# EAGLE schematic led_board (EAGLE 6.1)
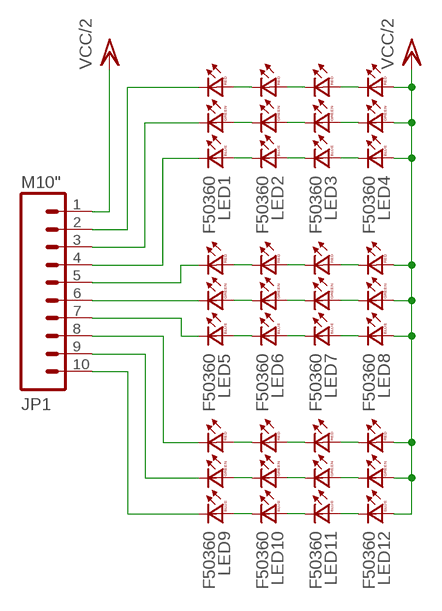
[diagram p0: schematic, sheet 1]

## Parts
JP1  M10"  [1X10]
LED1  F50360  [F50360]
LED2  F50360  [F50360]
LED3  F50360  [F50360]
LED4  F50360  [F50360]
LED5  F50360  [F50360]
LED6  F50360  [F50360]
LED7  F50360  [F50360]
LED8  F50360  [F50360]
LED9  F50360  [F50360]
LED10  F50360  [F50360]
LED11  F50360  [F50360]
LED12  F50360  [F50360]

## Nets
N$1: LED1.BA LED2.BC
N$2: LED1.GA LED2.GC
N$3: LED1.RA LED2.RC
N$4: LED2.BA LED3.BC
N$5: LED2.GA LED3.GC
N$6: LED2.RA LED3.RC
N$7: LED3.BA LED4.BC
N$8: LED3.GA LED4.GC
N$9: LED3.RA LED4.RC
N$10: LED5.BA LED6.BC
N$11: LED5.GA LED6.GC
N$12: LED5.RA LED6.RC
N$13: LED6.BA LED7.BC
N$14: LED6.GA LED7.GC
N$15: LED6.RA LED7.RC
N$16: LED7.BA LED8.BC
N$17: LED7.GA LED8.GC
N$18: LED7.RA LED8.RC
N$19: LED9.BA LED10.BC
N$20: LED9.GA LED10.GC
N$21: LED9.RA LED10.RC
N$22: LED10.BA LED11.BC
N$23: LED10.GA LED11.GC
N$24: LED10.RA LED11.RC
N$25: LED11.BA LED12.BC
N$26: LED11.GA LED12.GC
N$27: LED11.RA LED12.RC
N$28: JP1.2 LED1.RC
N$29: JP1.3 LED1.GC
N$30: JP1.4 LED1.BC
N$31: JP1.5 LED5.RC
N$32: JP1.6 LED5.GC
N$33: JP1.7 LED5.BC
N$34: JP1.8 LED9.RC
N$35: JP1.9 LED9.GC
N$36: JP1.10 LED9.BC
VCC/2: JP1.1 LED4.BA LED4.GA LED4.RA LED8.BA LED8.GA LED8.RA LED12.BA LED12.GA LED12.RA

## Library data of the parts
JP1 = sparkfun:M10: Header 10 Standard 10-pin 0.1" header. Use with straight break away headers (SKU : PRT-00116), right angle break away headers (PRT-00553), swiss pins (PRT-00743), machine pins (PRT-00117), and female headers (PRT-00115).
LED1-LED12 = led:F50360: Full color Z-Power LED RGB P5-II Series Source: http://www.seoulsemicon.co.kr .. F50360.pdf